# EAGLE design magnet driver (EAGLE 9.5.2)

## Sheet 1 of 2
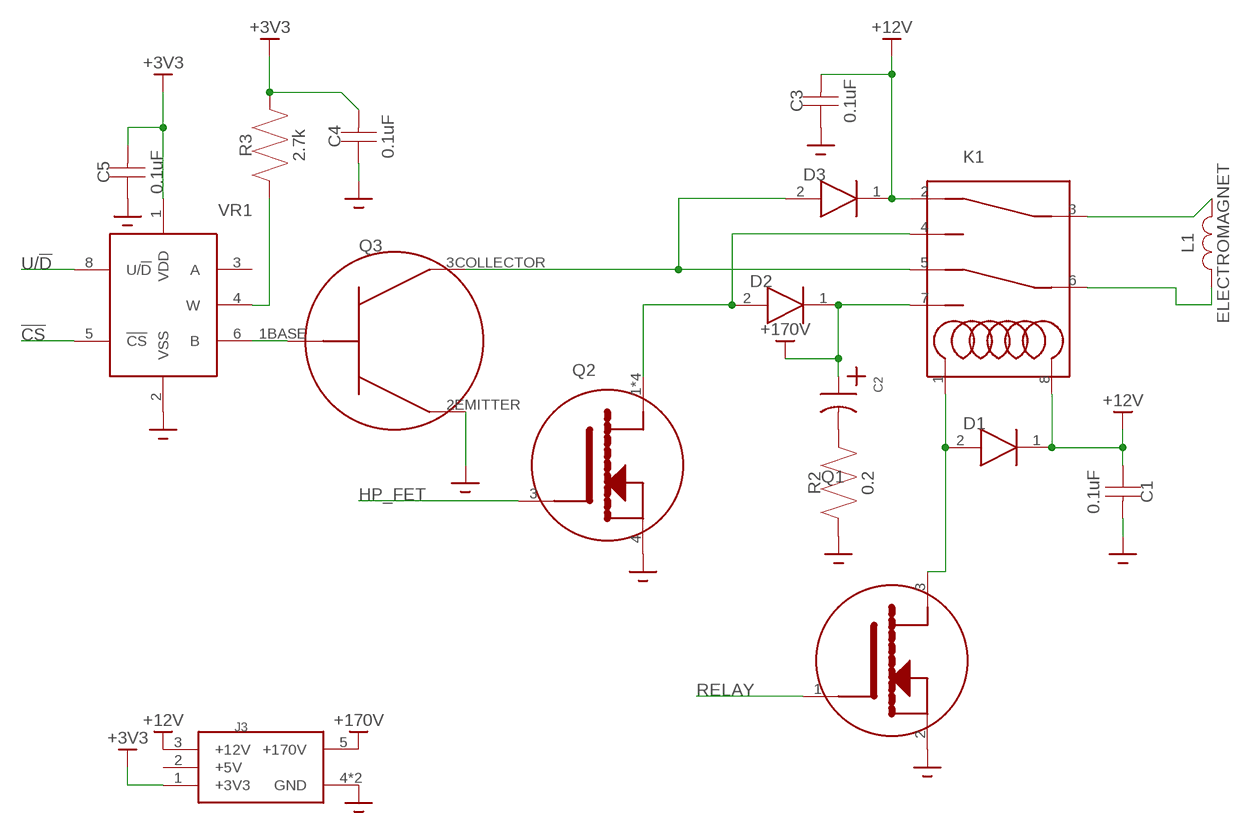
[diagram p0: schematic, sheet 1]

### Parts
C1  0.1uF  CAPACITOR0805  [0805]
C2  ESMQ351VSN102MA50S  [ESMQ351VSN102MA50S]
C3  0.1uF  CAPACITOR0805  [0805]
C4  0.1uF  CAPACITOR0805  [0805]
C5  0.1uF  CAPACITOR0805  [0805]
D1  BAT54HT1GBAT54HT1G  [SOD2512X110N]
D2  BAT54HT1GBAT54HT1G  [SOD2512X110N]
D3  BAT54HT1GBAT54HT1G  [SOD2512X110N]
J3  1-770969-0  [1-770969-0]
K1  G2RL-2DC12  [G2RL-2DC12]
L1  ELECTROMAGNET  [ELECTROMAGNET]
Q1  RK7002BMT116  [SOT95P240X120-3N]
Q2  DMN1019UVT-7DMN1019UVT-7  [SOT95P280X100-6N]
Q3  PMBT2222A,215PMBT2222A,215  [SOT95P230X110-3N]
R2  0.2  RESISTOR0805  [0805]
R3  2.7k  RESISTOR0805  [0805]
VR1  MCP4011-103E/MSMCP4011-103E/MS  [SOP65P490X265-8N]

### Nets
!CS: VR1.5(!CS) ; also sheet 2
+3V3: C4.P$2 C5.P$2 J3.1(+3V3) R3.P$2 VR1.1(VDD) ; also sheet 2
+12V: C1.P$1 C3.P$2 D1.1(CATHODE(1)) D3.1(CATHODE(1)) J3.3(+12V) K1.2(A1) K1.8(COILOUT)
+170V: C2.+ D2.1(CATHODE(1)) J3.5(+170V) K1.7(B2)
GND: C1.P$2 C3.P$1 C4.P$1 C5.P$1 J3.4(GND) J3.6(GND) Q1.2(SOURCE(2)) Q2.4(SOURCE(2)) Q3.2EMITTER(2E) R2.P$1 VR1.2(VSS) ; also sheet 2
HP_FET: Q2.3(GATE(1)) ; also sheet 2
N$1: K1.3(A) L1.-
N$2: C2.- R2.P$2
N$3: D1.2(ANODE(2)) K1.1(COILIN) Q1.3(DRAIN(3))
N$4: K1.6(B) L1.+
N$5: Q3.1BASE(1B) VR1.6(B)
N$6: R3.P$1 VR1.4(W)
N$7: D3.2(ANODE(2)) K1.5(B1) Q3.3COLLECTOR(3C)
N$8: D2.2(ANODE(2)) K1.4(A2) Q2.1(DRAIN(3)) Q2.2(DRAIN(3)) Q2.5(DRAIN(3)) Q2.6(DRAIN(3))
RELAY: Q1.1(GATE(1)) ; also sheet 2
U/!D: VR1.8(U/!D) ; also sheet 2
Unconnected: VR1.3(A)

## Sheet 2 of 2
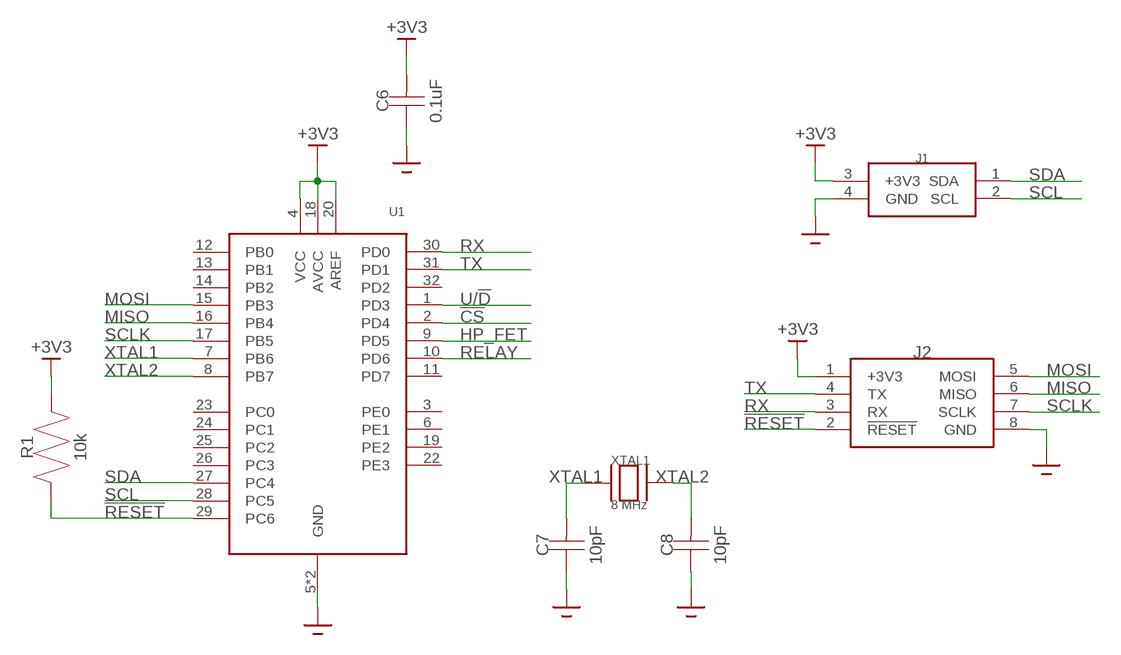
[diagram p1: schematic, sheet 2]

### Parts
C6  0.1uF  CAPACITOR0805  [0805]
C7  10pF  CAPACITOR0805  [0805]
C8  10pF  CAPACITOR0805  [0805]
J1  1-770968-0  [1-770968-0]
J2  DF1BZ-8DP-2.5DSA  [DF1BZ-8DP-2.5DSA]
R1  10k  RESISTOR0805  [0805]
U1  ATMEGA328PB32-TQFP  [ATMEGA328PB]
XTAL1  8 MHz  XRCGB  [XRCGB]

### Nets
!CS: U1.2(PD4) ; also sheet 1
!RESET: J2.2(!RESET) R1.P$1 U1.29(PC6)
+3V3: C6.P$2 J1.3(+3V3) J2.1(+3V3) R1.P$2 U1.4(VCC) U1.18(AVCC) U1.20(AREF) ; also sheet 1
GND: C6.P$1 C7.P$1 C8.P$1 J1.4(GND) J2.8(GND) U1.5(GND) U1.21(GND) ; also sheet 1
HP_FET: U1.9(PD5) ; also sheet 1
MISO: J2.6(MISO) U1.16(PB4)
MOSI: J2.5(MOSI) U1.15(PB3)
RELAY: U1.10(PD6) ; also sheet 1
RX: J2.3(RX) U1.30(PD0)
SCL: J1.2(SCL) U1.28(PC5)
SCLK: J2.7(SCLK) U1.17(PB5)
SDA: J1.1(SDA) U1.27(PC4)
TX: J2.4(TX) U1.31(PD1)
U/!D: U1.1(PD3) ; also sheet 1
XTAL1: C7.P$2 U1.7(PB6) XTAL1.1 XTAL1.3
XTAL2: C8.P$2 U1.8(PB7) XTAL1.2 XTAL1.4
Unconnected: U1.3(PE0) U1.6(PE1) U1.11(PD7) U1.12(PB0) U1.13(PB1) U1.14(PB2) U1.19(PE2) U1.22(PE3) U1.23(PC0) U1.24(PC1) U1.25(PC2) U1.26(PC3) U1.32(PD2)

## Power pins joined to a net without a drawn wire
+5V: J3.2(+5V)

## Library data of the parts
C1 C3-C8 = Zach:CAPACITOR
C2 = Zach:ESMQ351VSN102MA50S
D1-D3 = Dane:BAT54HT1G
J1 = Zach:1-770968-0
J2 = Zach:DF1BZ-8DP-2.5DSA
J3 = Zach:1-770969-0
K1 = Jim:G2RL-2DC12
L1 = Zach:ELECTROMAGNET
Q1 = Dane:RK7002BMT116
Q2 = Dane:DMN1019UVT-7
Q3 = Jim:PMBT2222A,215
R1-R3 = Zach:RESISTOR
U1 = Zach:ATMEGA328PB
VR1 = Jim:MCP4011-103E/MS
XTAL1 = Zach:XRCGB

## Board
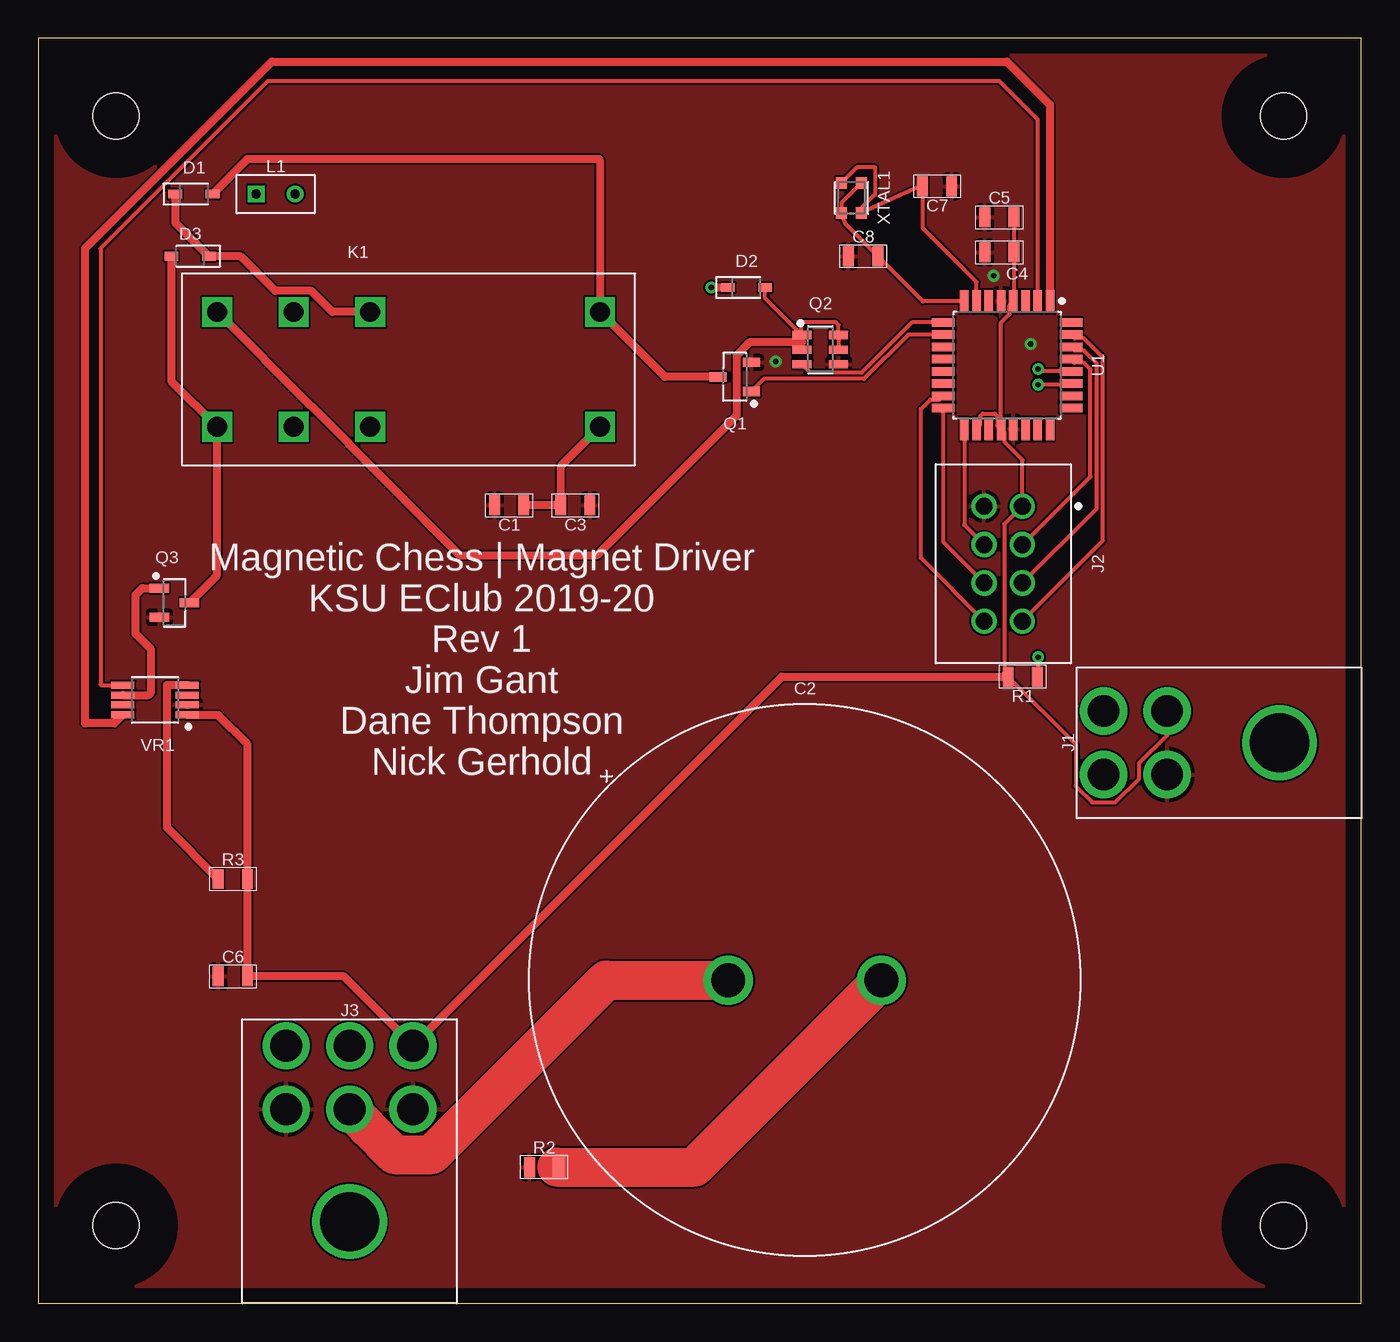
[diagram p2: board, top side]
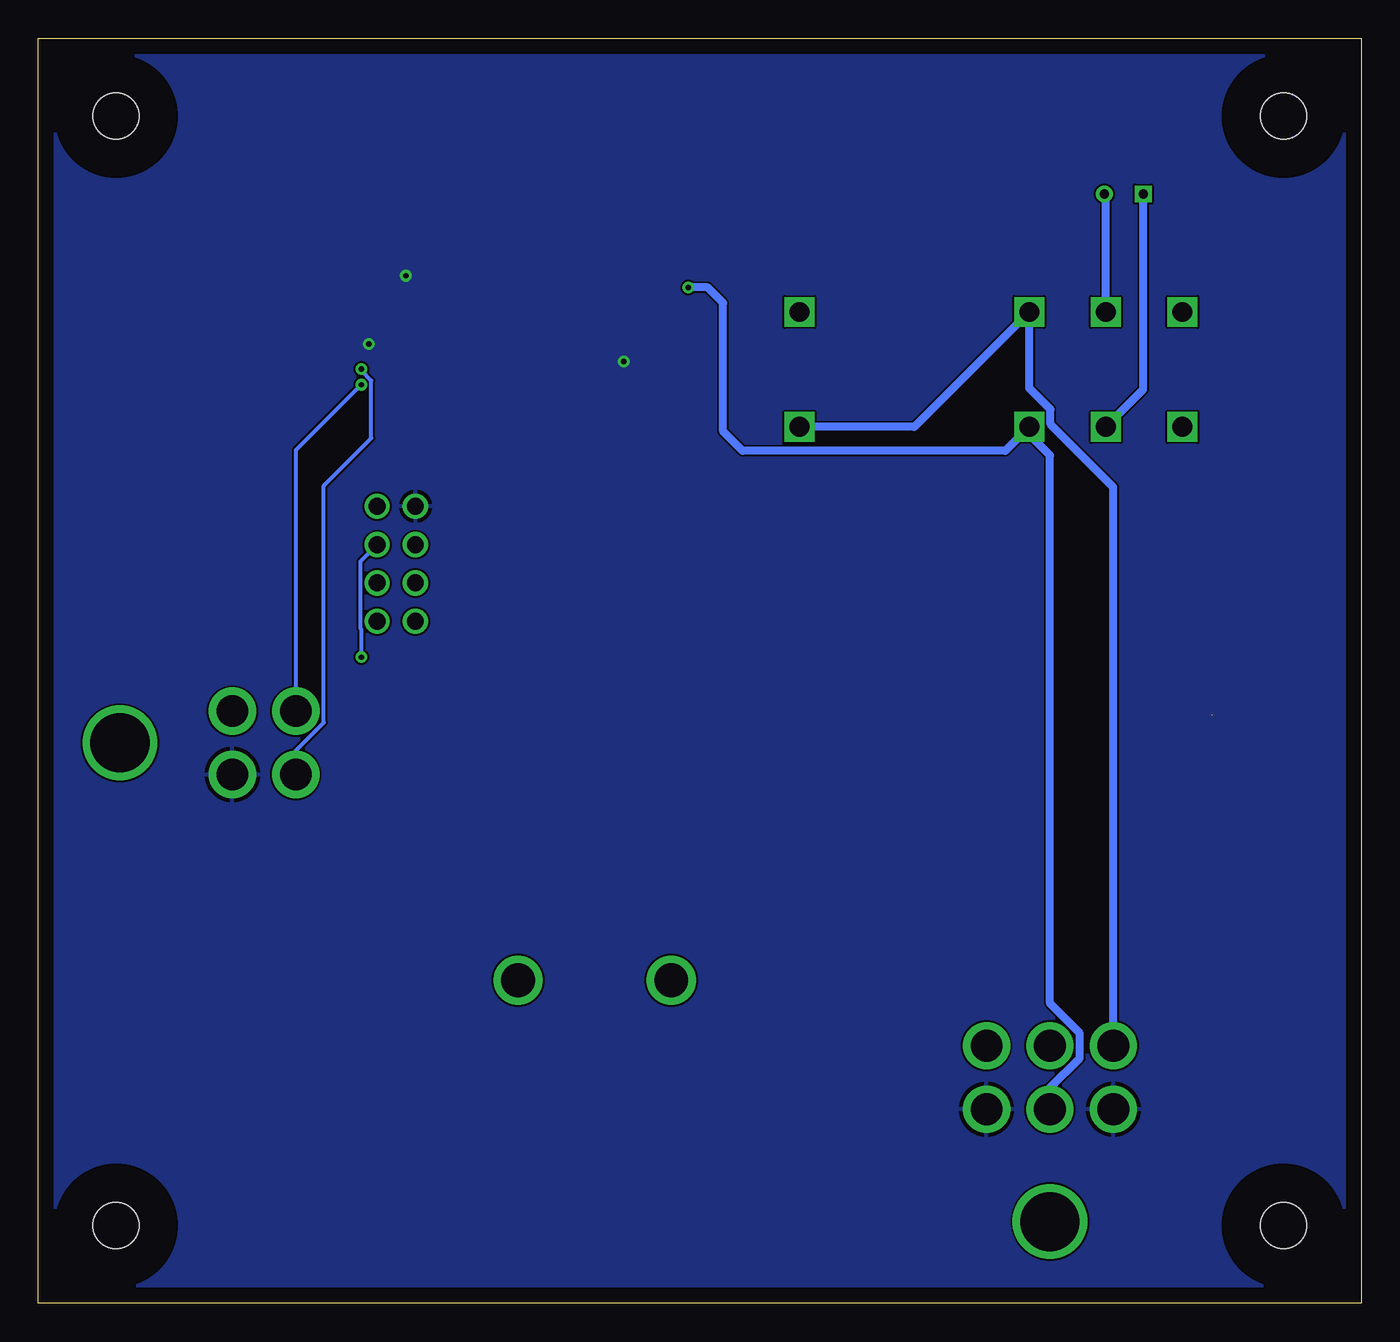
[diagram p3: board, bottom side, seen from below]

Size 86.36 x 82.55 mm. Coordinates in mm from the lower left corner, seen from the top.
Outline: 0,0 86.36,0 86.36,82.55 0,82.55 0,0
Copper layers (1*16): Top 0.035mm / dielectric 1.5mm / Bottom 0.035mm
Design rules "default *": minimum track width 6mil, minimum drill 0.35mm, track to track 5mil, track to pad 5mil, pad to pad 5mil, via to via 5mil, smd to smd 5mil, copper to edge 40mil, drill to drill 6mil, minimum pad ring 10mil, minimum via ring 8mil, stop-mask expansion 4mil, vias tented up to drill 0mil, thermal gap 10mil
Holes 3 mm at 81.28,5.08 81.28,77.47 5.08,5.08 5.08,77.47
tRestrict: area 77.3,1.1 to 85.3,9.1; area 77.3,73.5 to 85.3,81.5; area 1.1,1.1 to 9.1,9.1; area 1.1,73.5 to 9.1,81.5
bRestrict: area 77.3,1.1 to 85.3,9.1; area 77.3,73.5 to 85.3,81.5; area 1.1,1.1 to 9.1,9.1; area 1.1,73.5 to 9.1,81.5

### Footprints (pad centres in the part's own frame; a part is rotated, then mirrored left to right if it is on the bottom)
0805 = smd 0.711 x 1.295: P$1 -0.953,0; P$2 0.953,0
ESMQ351VSN102MA50S = drill 2.2 pad 2.8: + -5,0; - 5,0
SOD2512X110N = smd 0.888 x 0.572: 1 -1.221,0; 2 1.221,0
1-770968-0 = drill 2.07: 1 2.07,16.81; 2 -2.07,16.81; 3 2.07,12.67; 4 -2.07,12.67 | drill 3.86: 5 0,5.33
DF1BZ-8DP-2.5DSA = drill 1.1: 1 -3.75,1.25; 2 -1.25,1.25; 3 1.25,1.25; 4 3.75,1.25; 5 3.75,-1.25; 6 1.25,-1.25; 7 -1.25,-1.25; 8 -3.75,-1.25
1-770969-0 = drill 2.07: 1 4.14,16.81; 2 0,16.81; 3 -4.14,16.81; 4 4.14,12.67; 5 0,12.67; 6 -4.14,12.67 | drill 3.86: 7 0,5.33
G2RL-2DC12 = drill 1.3 square: 1 10,5; 2 -5,5; 3 -10,5; 4 -15,5; 5 -15,-2.5; 6 -10,-2.5; 7 -5,-2.5; 8 10,-2.5
ELECTROMAGNET = drill 0.6 square: + -1.27,0 | drill 0.6: - 1.27,0
SOT95P240X120-3N = smd 1.115 x 0.597: 1 -1.1,0.95; 2 -1.1,-0.95; 3 1.1,0
SOT95P280X100-6N = smd 1.237 x 0.547: 1 -1.187,0.95; 2 -1.187,0; 3 -1.187,-0.95; 4 1.187,-0.95; 5 1.187,0; 6 1.187,0.95
SOT95P230X110-3N = smd 1.259 x 0.59: 1BASE -0.978,0.95; 2EMITTER -0.978,-0.95; 3COLLECTOR 0.978,0
ATMEGA328PB = smd 1.469 x 0.547: 1 -4.171,2.8; 2 -4.171,2; 3 -4.171,1.2; 4 -4.171,0.4; 5 -4.171,-0.4; 6 -4.171,-1.2; 7 -4.171,-2; 8 -4.171,-2.8; 17 4.171,-2.8; 18 4.171,-2; 19 4.171,-1.2; 20 4.171,-0.4; 21 4.171,0.4; 22 4.171,1.2; 23 4.171,2; 24 4.171,2.8 | smd 0.547 x 1.469: 9 -2.8,-4.171; 10 -2,-4.171; 11 -1.2,-4.171; 12 -0.4,-4.171; 13 0.4,-4.171; 14 1.2,-4.171; 15 2,-4.171; 16 2.8,-4.171; 25 2.8,4.171; 26 2,4.171; 27 1.2,4.171; 28 0.4,4.171; 29 -0.4,4.171; 30 -1.2,4.171; 31 -2,4.171; 32 -2.8,4.171
SOP65P490X265-8N = smd 1.503 x 0.457: 1 -2.104,0.975; 2 -2.104,0.325; 3 -2.104,-0.325; 4 -2.104,-0.975; 5 2.104,-0.975; 6 2.104,-0.325; 7 2.104,0.325; 8 2.104,0.975
XRCGB = smd 0.75 x 0.7: 1 0.975,0.65; 2 -0.975,0.65; 3 -0.975,-0.65; 4 0.975,-0.65

### Placement (x,y rotation side)
C1  30.73,52.07 180 top
C2  50.04,21.08 0 top
C3  35.05,52.07 180 top
C4  62.74,68.58 0 top
C5  62.74,70.87 0 top
C6  12.7,21.34 0 top
C7  58.67,72.9 180 top
C8  53.85,68.33 0 top
D1  10.16,72.39 0 top
D2  46.23,66.29 0 top
D3  9.91,68.33 180 top
J1  86.36,36.58 90 top
J2  62.99,48.26 270 top
J3  20.32,0 0 top
K1  26.67,59.69 0 top
L1  15.49,72.39 0 top
Q1  45.47,60.45 180 top
Q2  51.05,62.23 0 top
Q3  8.89,45.72 0 top
R1  64.26,40.89 180 top
R2  33.02,8.89 0 top
R3  12.7,27.69 0 top
U1  63.25,61.21 270 top
VR1  7.62,39.37 180 top
XTAL1  53.09,72.14 270 top

### Tracks (layer width: path | path; a pad name or v marks a point on that pad's centre or on a via)
!CS
  Top 0.254: U1.2 65.25,77.25 62.74,79.76 14.99,79.76 4.06,68.83 4.06,40.39 4.11,40.34 VR1.5
!RESET  (via drill 0.35)
  Top 0.254: J2.2 68.69,53.95 68.69,60.95 68.27,61.37 67.66,61.37 U1.29 | v65.28,42.16 65.28,41.15 65.22,41.08 R1.P$1
  Bottom 0.254: v65.28,42.16 65.28,43.98 65.35,44.05 65.35,48.41 J2.2
+3V3  (1 unrouted)
  Top 0.254: U1.20 63.09,56.8 63.09,56.19 64.24,55.04 J2.1 63.06,50.82 63.06,41.15 R1.P$2 67.73,36.48 67.73,33.75 68.8,32.68 70.31,32.68 71.87,34.25 71.87,35.26 73.69,37.08 J1.3 | U1.18 61.49,57.29 61.49,57.89 61.66,58.06 62.44,58.06 62.6,57.89 62.6,57.29 U1.20 | U1.20 62.85,63.98 63.4,64.53 63.4,65.14 U1.4 63.69,65.43 C4.P$2 C5.P$2
  Top 0.508: R1.P$2 48.54,40.89 J3.1 19.93,21.34 C6.P$2 R3.P$2 13.65,36.48 11.76,38.38 10.54,38.38 9.72,38.38
+12V
  Top 0.508: K1.2 19.2,64.69 17.81,66.07 15.46,66.07 13.21,68.33 D3.1 8.94,70.51 D1.1 | K1.8 34.1,54.62 C3.P$2 C1.P$1
  Bottom 0.508: J3.3 16.18,53.26 20.29,57.37 20.29,58.33 21.67,59.72 K1.2 29.17,57.19 K1.8
+170V  (via drill 0.35)
  Top 0.508: v43.94,66.29 D2.1
  Top 2.54: J3.5 21.5,11.49 21.5,11.44 23.23,9.71 25.69,9.71 37.07,21.08 C2.+
  Bottom 0.508: J3.5 20.32,14.05 18.37,16 18.37,17.62 20.32,19.57 20.32,55.33 21.67,56.68 K1.7 23.23,55.63 40.39,55.63 41.66,56.9 41.66,65.28 42.67,66.29 v43.94,66.29
GND  (via drill 0.35)
  other vias: 64.77,62.61 62.36,67.06 48.13,61.47
  pour Top: 0,0 0,82.55 86.36,82.55 86.36,0
  pour Bottom: 0,0 0,82.55 86.36,82.55 86.36,0
HP_FET
  Top 0.254: U1.9 57.02,64.01 53.74,60.73 50.42,60.73 Q2.3
MISO
  Top 0.254: U1.16 59.08,49.68 J2.6
MOSI
  Top 0.254: U1.15 58.83,58.97 58.22,58.97 57.61,58.35 57.61,48.64 J2.5
N$1
  Bottom 0.508: K1.3 16.67,72.3 L1.-
N$2
  Top 0.254: R2.P$2 33.85,8.89
  Top 2.54: C2.- 42.85,8.89 33.85,8.89
N$3
  Top 0.508: D1.2 13.67,74.68 36.58,74.68 36.67,74.58 K1.1 40.91,60.45 Q1.3
N$4
  Bottom 0.508: K1.6 14.22,59.64 L1.+
N$5
  Top 0.508: VR1.6 7.18,39.7 7.37,39.88 7.37,42.67 6.35,43.69 6.35,46.23 6.79,46.67 Q3.1BASE
N$6
  Top 0.508: VR1.4 8.38,40.34 8.38,31.05 R3.P$1
N$7
  Top 0.508: Q3.3COLLECTOR 11.67,47.52 K1.5 8.69,60.17 D3.2
N$8
  Top 0.254: Q2.5 Q2.6 52.24,63.84 52.07,64.01 49.78,64.01 49.78,63.26 Q2.1 | Q2.2 49.87,62.74 Q2.1 | Q2.1 47.45,65.6 D2.2
  Top 0.508: K1.4 17.79,58.57 17.81,58.57 20.29,56.1 20.29,56.05 27.5,48.83 36.47,48.83 45.6,57.97 45.6,61.87 46.47,62.74 49.87,62.74
RELAY
  Top 0.254: U1.10 56.8,63.21 53.91,60.32 47.38,60.32 Q1.1
RX
  Top 0.254: J2.3 69.09,51.86 69.09,61.34 68.27,62.17 67.66,62.17 U1.30
SCL  (via drill 0.35)
  Top 0.254: U1.28 65.42,60.81 v65.28,60.96
  Bottom 0.254: v65.28,60.96 65.28,60.87 64.62,60.22 64.62,56.45 67.73,53.35 67.73,37.89 69.55,36.07 J1.2
SCLK
  Top 0.254: U1.17 60.45,50.81 J2.7
SDA  (via drill 0.35)
  Top 0.254: U1.27 67.35,59.94 v65.28,59.94
  Bottom 0.254: v65.28,59.94 69.55,55.67 J1.1
TX
  Top 0.254: J2.4 69.5,49.77 69.5,61.74 68.27,62.97 67.66,62.97 U1.31
U/!D
  Top 0.508: VR1.8 4.97,37.85 3.05,37.85 3.05,68.83 15.24,81.03 63.25,81.03 66.05,78.23 U1.1
XTAL1
  Top 0.254: U1.7 61.25,66.66 57.72,70.18 C7.P$2 57.55,72.89 XTAL1.1 53.74,71.48 54.62,72.37 54.62,74.13 53.45,74.13 XTAL1.3
XTAL2
  Top 0.254: U1.8 57.74,65.39 C8.P$2 52.69,70.43 XTAL1.4 52.44,71.81 XTAL1.2

### Text on the board
tPlace: Magnetic Chess | Magnet Driver / KSU EClub 2019-20 / Rev 1 / Jim Gant / Dane Thompson / Nick Gerhold